# Altium project MB1635.PrjPcb (part 2 of 4)

## Sheet Power_Board.SchDoc: Board power
size A3; Project: STM32MP15-DISCO; Date: Not used; ApprovedBy: Not used; CheckedBy: Not used; Author: Not used; CompanyName: STMicroelectronics; DrawnBy: Not used; Engineer: Not used; Organization: Not used; Address1: Not used; Address2: Not used; Address3: Not used; Address4: Not used; DocumentNumber: 5; Revision: Not used; SheetNumber: 5; SheetTotal: 17; CurrentTime: Not used; CurrentDate: Not used; Time: Not used; DocumentFullPathAndName: Not used; DocumentName: Not used; ModifiedDate: Not used; ImagePath: Not used; ProjectName: Not used; Application_BuildNumber: Not used
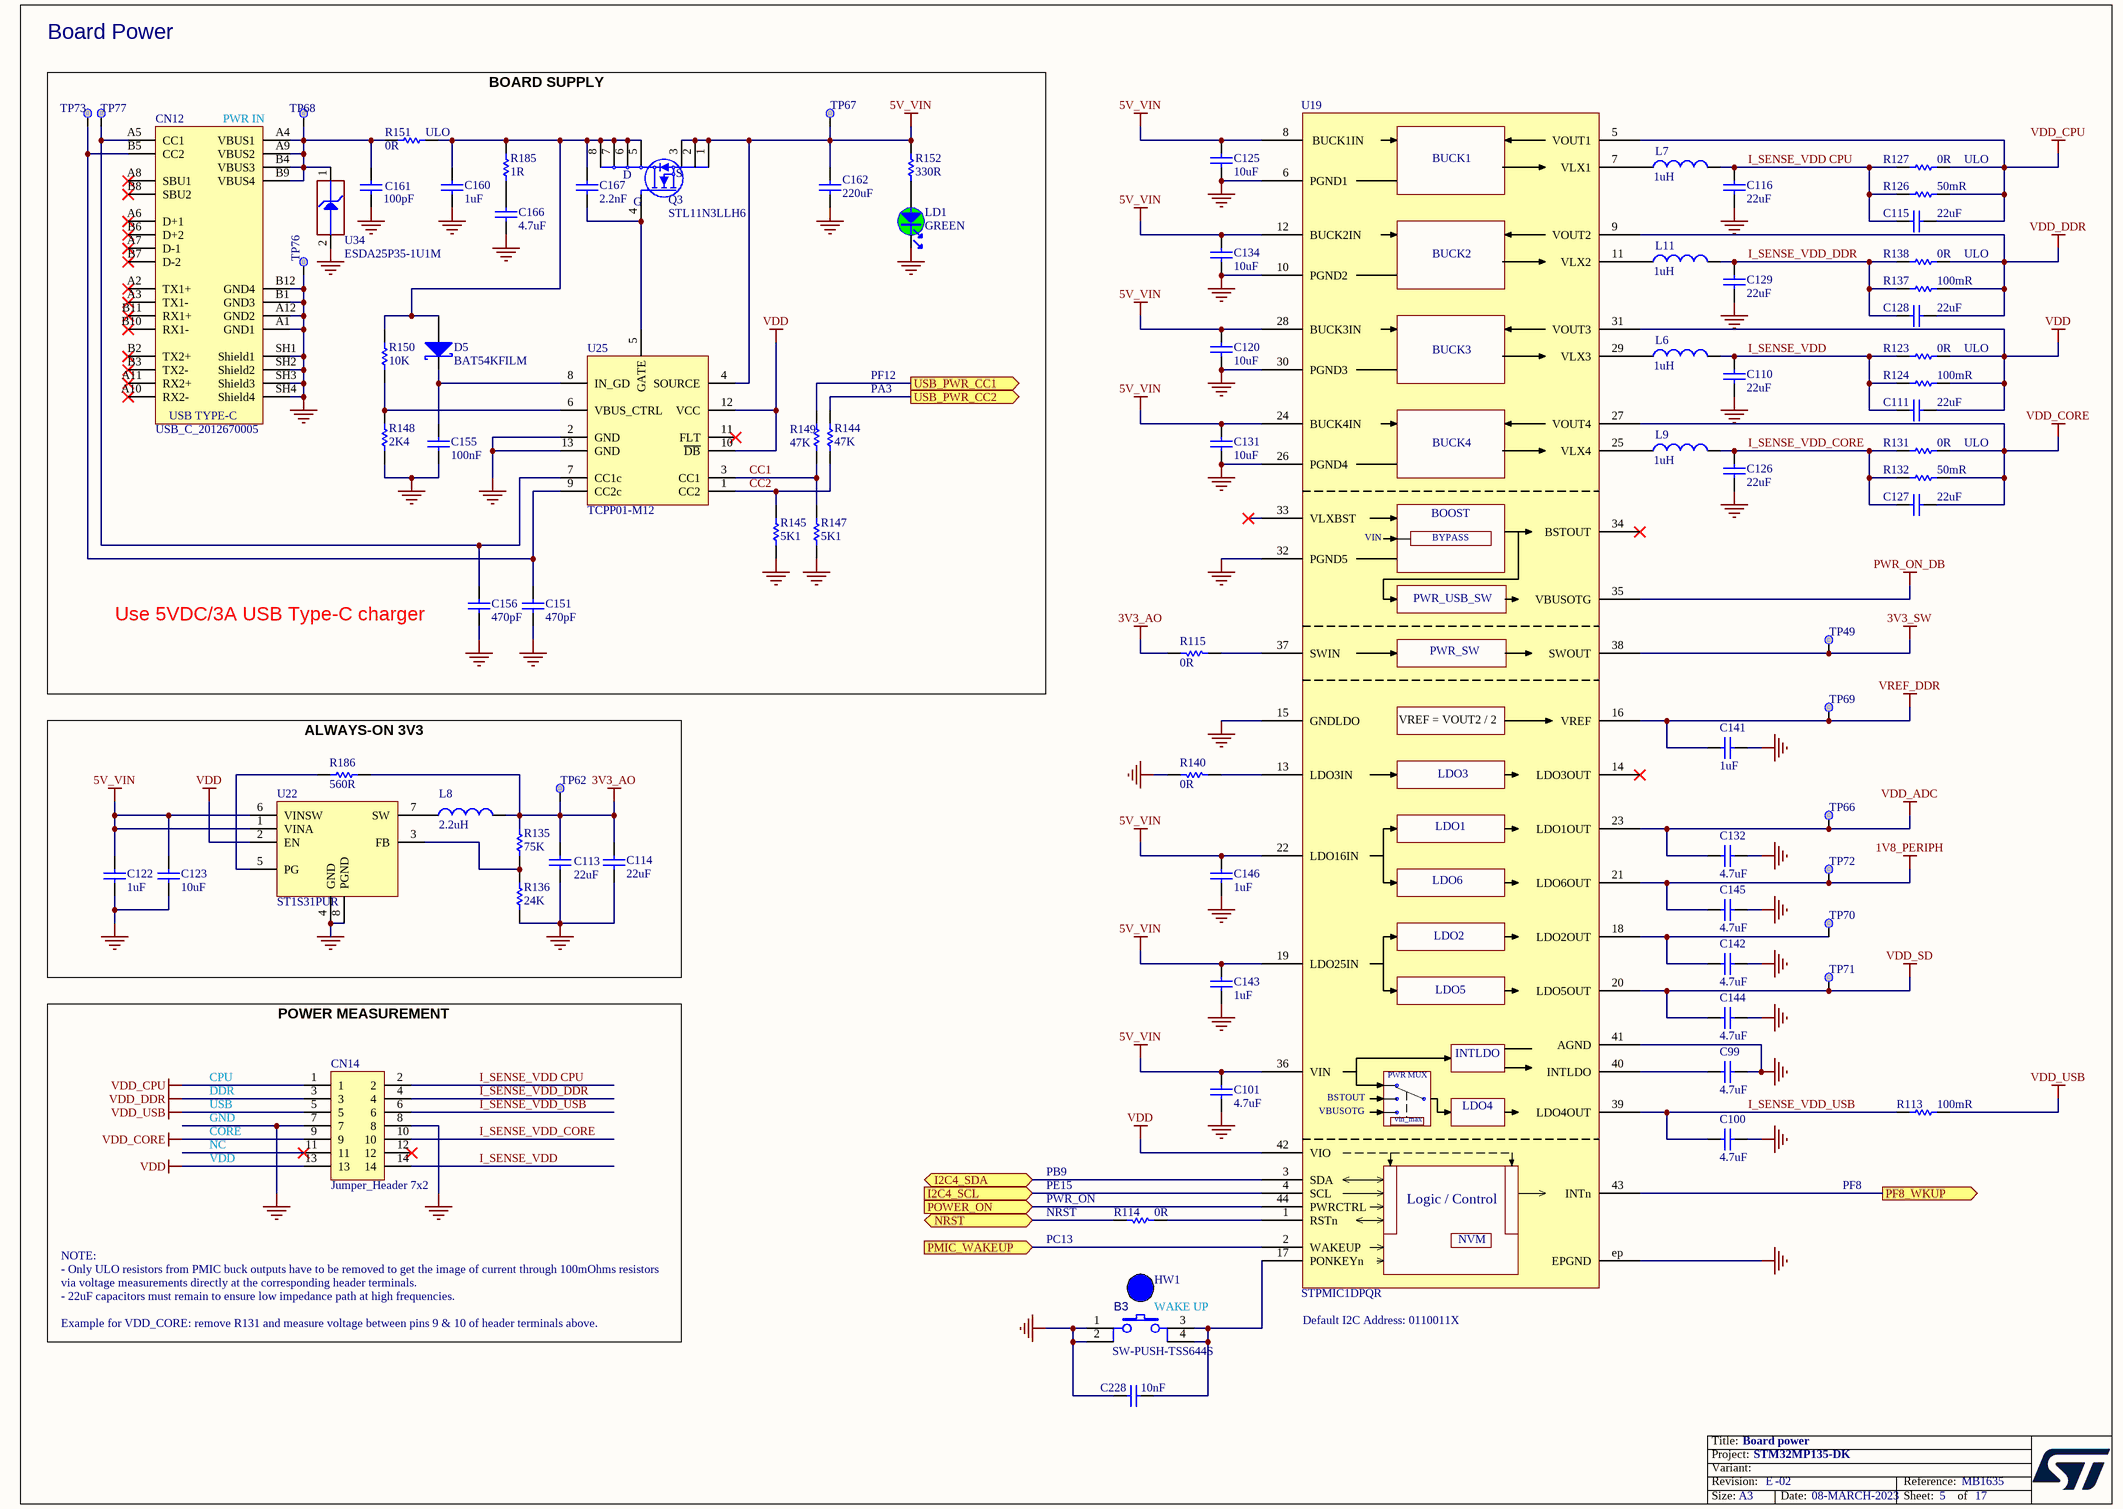
[diagram p3: Power_Board.SchDoc]

### Parts
B3  value SW-PUSH-TSS644S  [SWI_KNITTER_TSS644S]  (hidden comment: SW_PUSH_SMD)
C99  value 4.7uF  [C0402]  (hidden comment: Capacitor)
C100  value 4.7uF  [C0402]  (hidden comment: Capacitor)
C101  value 4.7uF  [C0402]  (hidden comment: Capacitor)
C110  value 22uF  [C0603]  (hidden comment: Capacitor)
C111  value 22uF  [C0603]  (hidden comment: Capacitor)
C113  value 22uF  [C0603]  (hidden comment: Capacitor)
C114  value 22uF  [C0603]  (hidden comment: Capacitor)
C115  value 22uF  [C0603]  (hidden comment: Capacitor)
C116  value 22uF  [C0603]  (hidden comment: Capacitor)
C120  value 10uF  [C0603]  (hidden comment: Capacitor)
C122  value 1uF  [C0402]  (hidden comment: Capacitor)
C123  value 10uF  [C0603]  (hidden comment: Capacitor)
C125  value 10uF  [C0603]  (hidden comment: Capacitor)
C126  value 22uF  [C0603]  (hidden comment: Capacitor)
C127  value 22uF  [C0603]  (hidden comment: Capacitor)
C128  value 22uF  [C0603]  (hidden comment: Capacitor)
C129  value 22uF  [C0603]  (hidden comment: Capacitor)
C131  value 10uF  [C0603]  (hidden comment: Capacitor)
C132  value 4.7uF  [C0402]  (hidden comment: Capacitor)
C134  value 10uF  [C0603]  (hidden comment: Capacitor)
C141  value 1uF  [C0402]  (hidden comment: Capacitor)
C142  value 4.7uF  [C0402]  (hidden comment: Capacitor)
C143  value 1uF  [C0402]  (hidden comment: Capacitor)
C144  value 4.7uF  [C0402]  (hidden comment: Capacitor)
C145  value 4.7uF  [C0402]  (hidden comment: Capacitor)
C146  value 1uF  [C0402]  (hidden comment: Capacitor)
C151  value 470pF  [C0402]  (hidden comment: Capacitor)
C155  value 100nF  [C0603]  (hidden comment: Capacitor)
C156  value 470pF  [C0402]  (hidden comment: Capacitor)
C160  value 1uF  [C0402]  (hidden comment: Capacitor)
C161  value 100pF  [C0402]  (hidden comment: Capacitor)
C162  value 220uF  [C1206_H1P6]  (hidden comment: Capacitor)
C166  value 4.7uF  [C0603]  (hidden comment: Capacitor)
C167  value 2.2nF  [C0603_H0P8]  (hidden comment: Capacitor)
C228  value 10nF  [C0402]  (hidden comment: Capacitor)
CN12  value USB_C_2012670005  [CON_USB-TYPEC_MOLEX_2012670005]  (hidden comment: USB_TYPE_C_Receptacle)
CN14  value Jumper_Header 7x2  [CON_SAMTEC_TSW-107-07-X-D]  (hidden comment: Header 7x2)
D5  value BAT54KFILM  [DIO_SOD523_1A_2K]  (hidden comment: SCHOTTKY_1A_2K)
HW1  Blue Hat  (value not drawn)  (mechanical)
L6  value 1uH  [IND_2520_TOKO_DFE252012P]  (hidden comment: IND_1uH_42mohm_3.2A)
L7  value 1uH  [IND_2520_TOKO_DFE252012P]  (hidden comment: IND_1uH_42mohm_3.2A)
L8  value 2.2uH  [IND_4025_WURTH_74404043022A]  (hidden comment: Inductor)
L9  value 1uH  [IND_2520_TOKO_DFE252012P]  (hidden comment: IND_1uH_42mohm_3.2A)
L11  value 1uH  [IND_2520_TOKO_DFE252012P]  (hidden comment: IND_1uH_42mohm_3.2A)
LD1  value GREEN  [LED_0603_GREEN]  (hidden comment: LED_green)
Q3  STL11N3LLH6  [MOS_POWERFLAT_3P3X3P3_P065]
R113  value 100mR  [R0603]  (hidden comment: Resistor)
R114  value 0R  [R0402]  (hidden comment: Resistor)
R115  value 0R  [R0402]  (hidden comment: Resistor)
R123  value 0R  [R0603]  (hidden comment: Resistor)
R124  value 100mR  [R0603]  (hidden comment: Resistor)
R126  value 50mR  [R0603]  (hidden comment: Resistor)
R127  value 0R  [R0603]  (hidden comment: Resistor)
R131  value 0R  [R0603]  (hidden comment: Resistor)
R132  value 50mR  [R0603]  (hidden comment: Resistor)
R135  value 75K  [R0402]  (hidden comment: Resistor)
R136  value 24K  [R0402]  (hidden comment: Resistor)
R137  value 100mR  [R0603]  (hidden comment: Resistor)
R138  value 0R  [R0603]  (hidden comment: Resistor)
R140  value 0R  [R0402]  (hidden comment: Resistor)
R144  value 47K  [R0402]  (hidden comment: Resistor)
R145  value 5K1  [R0402]  (hidden comment: Resistor)
R147  value 5K1  [R0402]  (hidden comment: Resistor)
R148  value 2K4  [R0402]  (hidden comment: Resistor)
R149  value 47K  [R0402]  (hidden comment: Resistor)
R150  value 10K  [R0402]  (hidden comment: Resistor)
R151  value 0R  [R0603]  (hidden comment: Resistor)
R152  value 330R  [R0402]  (hidden comment: Resistor)
R185  value 1R  [R0603]  (hidden comment: Resistor)
R186  value 560R  [R0402]  (hidden comment: Resistor)
TP49  Test Point  [TP_SMD_1MM]  (value not drawn)  (no BOM)
TP62  Test Point  [TP_SMD_1MM]  (value not drawn)  (no BOM)
TP66  Test Point  [TP_SMD_1MM]  (value not drawn)  (no BOM)
TP67  Test Point  [TP_SMD_1MM]  (value not drawn)  (no BOM)
TP68  Test Point  [TP_SMD_2MM]  (value not drawn)  (no BOM)
TP69  Test Point  [TP_SMD_1MM]  (value not drawn)  (no BOM)
TP70  Test Point  [TP_SMD_1MM]  (value not drawn)  (no BOM)
TP71  Test Point  [TP_SMD_1MM]  (value not drawn)  (no BOM)
TP72  Test Point  [TP_SMD_1MM]  (value not drawn)  (no BOM)
TP73  Test Point  [TP_SMD_1MM]  (value not drawn)  (no BOM)
TP76  Test Point  [TP_SMD_2MM]  (value not drawn)  (no BOM)
TP77  Test Point  [TP_SMD_1MM]  (value not drawn)  (no BOM)
U19  value STPMIC1DPQR  [ICC_WFQFN44-EPAD_5X6_P040]  (hidden comment: STPMU1)
U22  ST1S31PUR  [ICC_VFDFPN8-EPAD_3X3_P065]
U25  TCPP01-M12  [ICC_QFN12L-EPAD_3X3_P050]
U34  value ESDA25P35-1U1M  [ESD_QFN1610_2N_1K_2A]  (hidden comment: ESD-TRANSIL)

### Ports
I2C4_SCL (in), I2C4_SDA (bidir), NRST (bidir), PF8_WKUP (out), PMIC_WAKEUP (in), POWER_ON (in), USB_PWR_CC1 (out), USB_PWR_CC2 (out)

### Nets
1V8_PERIPH: C145.2 TP72.1 U19.21(LDO6OUT)
3V3_AO: C113.2 C114.2 L8.2 R115.1 R135.2 R186.2 TP62.1
3V3_SW: TP49.1 U19.38(SWOUT)
5V_VIN: C101.2 C120.2 C122.2 C123.2 C125.2 C131.2 C134.2 C143.2 C146.2 C162.1 Q3.1(S) Q3.2(S) Q3.3(S) R152.2 TP67.1 U19.8(BUCK1IN) U19.12(BUCK2IN) U19.19(LDO25IN) U19.22(LDO16IN) U19.24(BUCK4IN) U19.28(BUCK3IN) U19.36(VIN) U22.1(VINA) U22.6(VINSW) U25.4(SOURCE)
GND: B3.1 B3.2 C99.2 C100.1 C101.1 C110.1 C113.1 C114.1 C116.1 C120.1 C122.1 C123.1 C125.1 C126.1 C129.1 C131.1 C132.1 C134.1 C141.1 C142.1 C143.1 C144.1 C145.1 C146.1 C151.1 C155.2 C156.1 C160.2 C161.1 C162.2 C166.1 C228.1 CN12.A1(GND1) CN12.A12(GND2) CN12.B1(GND3) CN12.B12(GND4) CN12.SH1(Shield1) CN12.SH2(Shield2) CN12.SH3(Shield3) CN12.SH4(Shield4) CN14.7 CN14.8 LD1.2 R136.1 R140.1 R145.1 R147.1 R148.1 TP76.1 U19.6(PGND1) U19.10(PGND2) U19.15(GNDLDO) U19.26(PGND4) U19.30(PGND3) U19.32(PGND5) U19.41(AGND) U19.ep(EPGND) U22.4(GND) U22.8(PGND) U25.2(GND) U25.13(GND) U34.2(GND)
PWR_ON_DB: U19.35(VBUSOTG)
VDD: C111.2 CN14.13 R123.2 R124.2 U19.31(VOUT3) U19.42(VIO) U22.2(EN) U25.10(~{DB}) U25.12(VCC)
VDD_ADC: C132.2 TP66.1 U19.23(LDO1OUT)
VDD_CORE: C127.2 CN14.9 R131.2 R132.2 U19.27(VOUT4)
VDD_CPU: C115.2 CN14.1 R126.2 R127.2 U19.5(VOUT1)
VDD_DDR: C128.2 CN14.3 R137.2 R138.2 U19.9(VOUT2)
VDD_SD: C144.2 TP71.1 U19.20(LDO5OUT)
VDD_USB: CN14.5 R113.2
VREF_DDR: C141.2 TP69.1 U19.16(VREF)
CC1: R147.2 R149.1 U25.3(CC1)
CC2: R144.1 R145.2 U25.1(CC2)
I2C4_SCL: U19.4(SCL) ; port I2C4_SCL
I2C4_SDA: U19.3(SDA) ; port I2C4_SDA
I_SENSE_VDD: C110.2 C111.1 CN14.14 L6.2 R123.1 R124.1
I_SENSE_VDD CPU: C115.1 C116.2 CN14.2 L7.2 R126.1 R127.1
I_SENSE_VDD_CORE: C126.2 C127.1 CN14.10 L9.2 R131.1 R132.1
I_SENSE_VDD_DDR: C128.1 C129.2 CN14.4 L11.2 R137.1 R138.1
I_SENSE_VDD_USB: C100.2 CN14.6 R113.1 U19.39(LDO4OUT)
NRST: R114.1 ; port NRST
PF8_WKUP: U19.43(INTn) ; port PF8_WKUP
PMIC_WAKEUP: U19.2(WAKEUP) ; port PMIC_WAKEUP
POWER_ON: U19.44(PWRCTRL) ; port POWER_ON
USB_PWR_CC1: R149.2 ; port USB_PWR_CC1
USB_PWR_CC2: R144.2 ; port USB_PWR_CC2
NetB3_3: B3.3 B3.4 C228.2 U19.17(PONKEYn)
NetC99_1: C99.1 U19.40(INTLDO)
NetC142_2: C142.2 TP70.1 U19.18(LDO2OUT)
NetC151_2: C151.2 CN12.B5(CC2) TP73.1 U25.9(CC2c)
NetC155_1: C155.1 D5.2(K) U25.8(IN_GD)
NetC156_2: C156.2 CN12.A5(CC1) TP77.1 U25.7(CC1c)
NetC160_1: C160.1 C167.2 D5.1(A) Q3.5(D) Q3.6(D) Q3.7(D) Q3.8(D) R150.2 R151.2 R185.2
NetC161_2: C161.2 CN12.A4(VBUS1) CN12.A9(VBUS2) CN12.B4(VBUS3) CN12.B9(VBUS4) R151.1 TP68.1 U34.1(IO1)
NetC166_2: C166.2 R185.1
NetC167_1: C167.1 Q3.4(G) U25.5(GATE)
NetL6_1: L6.1 U19.29(VLX3)
NetL7_1: L7.1 U19.7(VLX1)
NetL8_1: L8.1 U22.7(SW)
NetL9_1: L9.1 U19.25(VLX4)
NetL11_1: L11.1 U19.11(VLX2)
NetLD1_1: LD1.1 R152.1
NetR114_2: R114.2 U19.1(RSTn)
NetR115_2: R115.2 U19.37(SWIN)
NetR135_1: R135.1 R136.2 U22.3(FB)
NetR140_2: R140.2 U19.13(LDO3IN)
NetR148_2: R148.2 R150.1 U25.6(VBUS_CTRL)
NetR186_1: R186.1 U22.5(PG)

Not connected (* = marked no-connect by the designer): CN12 A2(TX1+)* A3(TX1-)* A6(D+1)* A7(D-1)* A8(SBU1)* A10(RX2-)* A11(RX2+)* B2(TX2+)* B3(TX2-)* B6(D+2)* B7(D-2)* B8(SBU2)* B10(RX1-)* B11(RX1+)*; CN14 11* 12*; U19 14(LDO3OUT)* 33(VLXBST)* 34(BSTOUT)*; U25 11(FLT)*

### Notes on the sheet
- Board Power
- (near CN12) PWR IN
- (near R151) ULO
- ULO
- PF12
- PA3
- Use 5VDC/3A USB Type-C charger
- BOARD SUPPLY
- ALWAYS-ON 3V3
- CPU
- DDR
- USB
- GND
- VDD
- CORE
- NC
- PB9
- PE15
- PF8
- NRST
- (near R114) PWR_ON
- PC13
- NOTE:
  - Only ULO resistors from PMIC buck outputs have to be removed to get the image of current through 100mOhms resistors via voltage measurements directly at the corresponding header terminals.
  - 22uF capacitors must remain to ensure low impedance path at high frequencies.
  Example for VDD_CORE: remove R131 and measure voltage between pins 9 & 10 of header terminals above.
- (near B3) WAKE UP
- Default I2C Address: 0110011X
- (near CN14) POWER MEASUREMENT
- Title:
- Project:
- Size:
- Revision:
- Variant:
- A3
- -
- Date:
- Reference:
- Sheet:
- of
- (in symbol MCD-02275) BUCK1; BUCK2; BUCK3; BUCK4; BOOST; BYPASS; PWR_USB_SW; PWR_SW; VREF = VOUT2 / 2; LDO3; LDO1; LDO6; LDO2; LDO5; PWR MUX; LDO4; vin_max; Logic / Control; NVM
- (in symbol MCD-02421) USB TYPE-C

### Library data of the parts
B3 = MCD-02417: Push Button, NO, 0.05A, 12V, 2.6N, SMD, 9.0x6.2mm, T=7.3mm, changeable caps KTSC-6xx; Part_Type: Misc; Manufacturer_Part_Number: TSS644S; Manufacturer: KNITTER-SWITCH; Part_Preference: Recommended; Component_Country_Of_Origin: China; ShowFields: YES; ID: 4523; Internal_Part_Number: MCD-02417; Status: Released; ComponentLink1URL: http://tunmcdsvn.tun.st.com/Component_Documentation_Library/Trunk/Misc/KNITTER_TSS6x_Series; Order_Code_Digikey: N/A; Order_Code_Farnell: N/A; Order_Code_RS: N/A; Package: 9.0x6.2mm
C99-C101 C132 C142 C144 C145 = MCD-01356: Capacitor, MLCC, 4.7uF, 6V3, X5R, +/-20%, 0402, T=0.5mm; Manufacturer_Part_Number: GRM155R60J475ME47; Manufacturer: MURATA; Part_Preference: Recommended; Order_Code_RS: 814-5230; Component_Country_Of_Origin: Japan; ShowFields: YES; ID: 3456; Internal_Part_Number: MCD-01356; Status: Released; Part_Type: Capacitor; Package: 0402; ComponentLink1URL: http://tunmcdsvn.tun.st.com/Component_Documentation_Library/Trunk/Capacitor/MURATA_GRM_Series; Order_Code_Digikey: 490-5915-1-ND; Order_Code_Farnell: 2666407
C110 C116 C126 C129 = MCD-00100: Capacitor, MLCC, 22uF, 6V3, X5R, +/-20%, 0603, T=0.8mm; Manufacturer_Part_Number: GRM188R60J226MEA0J; Manufacturer: MURATA; Part_Preference: Recommended; Component_Country_Of_Origin: Japan; ShowFields: YES; ID: 2766; Internal_Part_Number: MCD-00100; Status: Released; Part_Type: Capacitor; Package: 0603; ComponentLink1URL: http://tunmcdsvn.tun.st.com/Component_Documentation_Library/Trunk/Capacitor/MURATA_GRM_Series; Order_Code_Digikey: 490-7612-2-ND; Order_Code_Farnell: N/A; Order_Code_RS: N/A
C111 C113-C115 C127 C128 = MCD-00100: Capacitor, MLCC, 22uF, 6V3, X5R, +/-20%, 0603, T=0.8mm; Part_Preference: Recommended; Manufacturer: MURATA; Manufacturer_Part_Number: GRM188R60J226MEA0J; Component_Country_Of_Origin: Japan; ShowFields: YES; ID: 2766; Internal_Part_Number: MCD-00100; Status: Released; Part_Type: Capacitor; Package: 0603; ComponentLink1URL: http://tunmcdsvn.tun.st.com/Component_Documentation_Library/Trunk/Capacitor/MURATA_GRM_Series; Order_Code_Digikey: 490-7612-2-ND; Order_Code_Farnell: N/A; Order_Code_RS: N/A
C120 C125 C131 C134 = MCD-00099: Capacitor, MLCC, 10uF, 10V, X5R, +/-10%, 0603, T=0.8mm; Manufacturer_Part_Number: GRM188R61A106KE69D; Manufacturer: MURATA; Part_Preference: Recommended; Order_Code_RS: 170-6168; Component_Country_Of_Origin: Japan; ShowFields: YES; ID: 2770; Internal_Part_Number: MCD-00099; Status: Released; Part_Type: Capacitor; Package: 0603; ComponentLink1URL: http://tunmcdsvn.tun.st.com/Component_Documentation_Library/Trunk/Capacitor/MURATA_GRM_Series; Order_Code_Digikey: 490-10474-1-ND; Order_Code_Farnell: 2494233
C122 = MCD-00095: Capacitor, MLCC, 1uF, 25V, X5R, +/-10%, 0402, T=0.5mm; Part_Preference: Recommended; Manufacturer: MURATA; Manufacturer_Part_Number: GRM155R61E105KA12; Order_Code_RS: 846-7287; Component_Country_Of_Origin: Japan; ShowFields: YES; ID: 2772; Internal_Part_Number: MCD-00095; Status: Released; Part_Type: Capacitor; Package: 0402; ComponentLink1URL: http://tunmcdsvn.tun.st.com/Component_Documentation_Library/Trunk/Capacitor/MURATA_GRM_Series; Order_Code_Digikey: 490-10017-1-ND; Order_Code_Farnell: 2218855
C123 = MCD-00099: Capacitor, MLCC, 10uF, 10V, X5R, +/-10%, 0603, T=0.8mm; Part_Preference: Recommended; Manufacturer: MURATA; Manufacturer_Part_Number: GRM188R61A106KE69D; Order_Code_RS: 170-6168; Component_Country_Of_Origin: Japan; ShowFields: YES; ID: 2770; Internal_Part_Number: MCD-00099; Status: Released; Part_Type: Capacitor; Package: 0603; ComponentLink1URL: http://tunmcdsvn.tun.st.com/Component_Documentation_Library/Trunk/Capacitor/MURATA_GRM_Series; Order_Code_Digikey: 490-10474-1-ND; Order_Code_Farnell: 2494233
C141 C143 C146 C160 = MCD-00095: Capacitor, MLCC, 1uF, 25V, X5R, +/-10%, 0402, T=0.5mm; Manufacturer_Part_Number: GRM155R61E105KA12; Manufacturer: MURATA; Part_Preference: Recommended; Order_Code_RS: 846-7287; Component_Country_Of_Origin: Japan; ShowFields: YES; ID: 2772; Internal_Part_Number: MCD-00095; Status: Released; Part_Type: Capacitor; Package: 0402; ComponentLink1URL: http://tunmcdsvn.tun.st.com/Component_Documentation_Library/Trunk/Capacitor/MURATA_GRM_Series; Order_Code_Digikey: 490-10017-1-ND; Order_Code_Farnell: 2218855
C151 C156 = MCD-00724: Capacitor, MLCC, 470pF, 50V, NPO, +/-5%, 0402, T=0.5mm; Manufacturer_Part_Number: CC0402JRNPO9BN471; Manufacturer: YAGEO; Part_Preference: Recommended; Order_Code_RS: 199-2186; Component_Country_Of_Origin: China; ShowFields: YES; ID: 3023; Internal_Part_Number: MCD-00724; Status: Released; Part_Type: Capacitor; Package: 0402; ComponentLink1URL: http://tunmcdsvn.tun.st.com/Component_Documentation_Library/Trunk/Capacitor/YAGEO_NP0_Series; Order_Code_Digikey: 311-1671-1-ND; Order_Code_Farnell: 3366416
C155 = MCD-01099: Capacitor, MLCC, 100nF, 50V, X7R, +/-10%, 0603, T=0.8mm; Manufacturer_Part_Number: CC0603KRX7R9BB104; Manufacturer: YAGEO; Part_Preference: Recommended; BMS_Part_Number: 9142278; Order_Code_RS: 669-8767; Component_Country_Of_Origin: China; ShowFields: YES; ID: 3397; Internal_Part_Number: MCD-01099; Status: Released; Part_Type: Capacitor; Package: 0603; ComponentLink1URL: http://tunmcdsvn.tun.st.com/Component_Documentation_Library/Trunk/Capacitor/YAGEO_X7R_Series; Order_Code_Digikey: 311-1344-1-ND; Order_Code_Farnell: 1362556
C161 = MCD-00205: Capacitor, MLCC, 100pF, 50V, NPO, +/-5%, 0402, T=0.5mm; Manufacturer_Part_Number: CC0402JRNPO9BN101; Manufacturer: YAGEO; Part_Preference: Recommended; Component_Country_Of_Origin: China; ShowFields: YES; ID: 2658; Internal_Part_Number: MCD-00205; Status: Released; Part_Type: Capacitor; Package: 0402; ComponentLink1URL: http://tunmcdsvn.tun.st.com/Component_Documentation_Library/Trunk/Capacitor/YAGEO_NP0_Series; Order_Code_Digikey: 311-1024-1-ND; Order_Code_Farnell: 3019226RL; Order_Code_RS: N/A
C162 = MCD-00104: Capacitor, MLCC, 220uF, 6V3, X5R, +/-20%, 1206, T=1.6mm; Manufacturer_Part_Number: GRM31CR60J227ME11; Manufacturer: MURATA; Part_Preference: Recommended; Order_Code_RS: 170-6396; Component_Country_Of_Origin: Japan; ShowFields: YES; ID: 2764; Internal_Part_Number: MCD-00104; Status: Released; Part_Type: Capacitor; Package: 1206; ComponentLink1URL: http://tunmcdsvn.tun.st.com/Component_Documentation_Library/Trunk/Capacitor/MURATA_GRM_Series; Order_Code_Digikey: 490-13970-1-ND; Order_Code_Farnell: 2494472
C166 = MCD-02196: Capacitor, MLCC, 4.7uF, 25V, X5R, +/-10%, 0603, T=0.8mm; Manufacturer_Part_Number: C1608X5R1E475K080AC; Manufacturer: TDK; Part_Preference: Recommended; Order_Code_RS: 9159158; Component_Country_Of_Origin: Unknown; ShowFields: YES; ID: 4296; Internal_Part_Number: MCD-02196; Status: Checked; Part_Type: Capacitor; Package: 0603; ComponentLink1URL: http://tunmcdsvn.tun.st.com/Component_Documentation_Library/Trunk/Capacitor/TDK_C_Series; Order_Code_Digikey: 445-9050-1-ND; Order_Code_Farnell: 2525101
C167 = MCD-02457: Capacitor, MLCC, 2.2nF, 50V, C0G/NPO, +/-5%, 0603, T=0,8mm; Part_Preference: Recommended; Manufacturer: YAGEO; Manufacturer_Part_Number: CC0603JRNPO9BN222; Order_Code_RS: 200-6484; Component_Country_Of_Origin: China; ShowFields: YES; ID: 4563; Internal_Part_Number: MCD-02457; Status: Released; Part_Type: Capacitor; Package: 0603; ComponentLink1URL: http://tunmcdsvn.tun.st.com/Component_Documentation_Library/Trunk/Capacitor/YAGEO_NP0_Series/; Order_Code_Digikey: 311-1771-2-ND; Order_Code_Farnell: 3369209
C228 = MCD-02198: Capacitor, MLCC, 10nF, 50V, X7R, +/-10%, 0402, T=0.5mm; Manufacturer_Part_Number: CC0402KRX7R9BB103; Manufacturer: YAGEO; Part_Preference: Recommended; Order_Code_RS: 6169644; Component_Country_Of_Origin: China; ShowFields: YES; ID: 4298; Internal_Part_Number: MCD-02198; Status: Checked; Part_Type: Capacitor; Package: 0402; ComponentLink1URL: http://tunmcdsvn.tun.st.com/Component_Documentation_Library/Trunk/Capacitor/YAGEO_X7R_Series; Order_Code_Digikey: N/A; Order_Code_Farnell: N/A
CN12 = MCD-02421: USB_TypeC, 24 pins, RA, SMD, T=3.71mm (USB Certified 3.1); Part_Type: Connector; Manufacturer_Part_Number: 2012670005; Manufacturer: MOLEX; Part_Preference: Recommended; Order_Code_RS: 176-8434; Component_Country_Of_Origin: Unknown; ShowFields: YES; ID: 4527; Internal_Part_Number: MCD-02421; Status: Released; ComponentLink1URL: http://tunmcdsvn.tun.st.com/Component_Documentation_Library/Trunk/Connector/MOLEX_201267_Series; Order_Code_Digikey: WM17992TR-ND; Order_Code_Farnell: 2990523
CN14 = MCD-02123: Header, 7x2, 2.54mm, VR, TH, T=5.84mm/2.54mm; Part_Preference: Recommended; Part_Type: Connector; Manufacturer: SAMTEC; Manufacturer_Part_Number: TSW-107-07-G-D; Component_Country_Of_Origin: China, Costa Rica, Malaysia, United States, Vietnam; ShowFields: YES; ID: 4223; Internal_Part_Number: MCD-02123; Status: Checked; ComponentLink1URL: http://tunmcdsvn.tun.st.com/Component_Documentation_Library/Trunk/Connector/SAMTEC_TSW_Series/; Order_Code_Digikey: N/A; Order_Code_Farnell: N/A; Order_Code_RS: N/A
D5 = MCD-01677: Small signal Schottky diodes; BMS_Part_Number: 9151123; Part_Preference: Recommended; Part_Type: Diode; Manufacturer: STMICROELECTRONICS; Manufacturer_HQ_COO: EU; Component_Country_Of_Origin: China; ShowFields: YES; ID: 3777; Internal_Part_Number: MCD-01677; Status: Checked; Manufacturer_Part_Number: BAT54KFILM; Package: SOD-523; ComponentLink1URL: http://tunmcdsvn.tun.st.com/Component_Datasheet_Library/Trunk/Diodes/STM_SCHOTTKY_DOUBLE_BAT54SWFILM/STM_SCHOTTKY_DOUBLE_BAT54SWFILM.pdf
HW1 = MCD-02136: Switch hat, blue, For KTSC-62B; Part_Type: Misc; Part_Preference: Recommended; Manufacturer: APEM INC; Manufacturer_Part_Number: AKTSC62B; Order_Code_RS: 378-6779; Component_Country_Of_Origin: Unknown; ShowFields: YES; ID: 4236; Value: Blue Hat; Order_Code_Digikey: AKTSC62B-ND; Order_Code_Farnell: N/A; Status: Released; ComponentLink1URL: http://tunmcdsvn.tun.st.com/Component_Datasheet_Library/Trunk/Mechanical/APEM_BLUEHAT_KTSC62; Internal_Part_Number: MCD-02136
L6 L7 L9 L11 = MCD-01122: Inductor, 1uH, +/-20%, 4.3A max, 0R042, 2520, T=1.2mm; Manufacturer_Part_Number: DFE252012P-1ROM=P2; Manufacturer: MURATA; Part_Preference: Recommended; Component_Country_Of_Origin: Japan; ShowFields: YES; ID: 3373; Internal_Part_Number: MCD-01122; Status: Checked; Part_Type: Inductor; Package: 2520; ComponentLink1URL: http://tunmcdsvn.tun.st.com/Component_Documentation_Library/Trunk/Inductor/MURATA_DFE252012P_Series; Order_Code_Digikey: N/A; Order_Code_Farnell: N/A; Order_Code_RS: N/A
L8 = MCD-02242: Inductor, 2.2uH, +/-30%, 3,83A, 0R023, 4x4mm, T=2.5mm; Part_Preference: Recommended; Manufacturer: WURTH ELEKTRONIK; Manufacturer_Part_Number: 74404043022A; Component_Country_Of_Origin: Unknown; ShowFields: YES; ID: 4342; Internal_Part_Number: MCD-02242; Status: Released; Part_Type: Inductor; Package: 4x4mm; ComponentLink1URL: http://tunmcdsvn.tun.st.com/Component_Documentation_Library/Trunk/Inductor/WURTH_ELEKTRONIK_74404043022A; Order_Code_Digikey: 732-10754-2-ND; Order_Code_Farnell: 2749069; Order_Code_RS: N/A
LD1 = MCD-00050: LED, Green, 0603; Part_Type: Display; Manufacturer_Part_Number: 19-213SYGC/S530-E2/TR8; Manufacturer: EVERLIGHT; Part_Preference: Forbidden; Component_Country_Of_Origin: China; ShowFields: YES; ID: 2542; Internal_Part_Number: MCD-00050; Status: Obsolete; ComponentLink1URL: http://tunmcdsvn.tun.st.com/Component_Datasheet_Library/Trunk/Display/Everlight_SMD-LED-GREEN_19-213SYGC-S530-XX-TR8-v3.doc; Package: LED 0603
Q3 = MCD-01810: N-channel 30 V, 6 mΩ typ, 11 A STripFET™ H6, Power MOSFET in a PowerFLAT™ 3.3x3.3 package; Part_Type: IC; Manufacturer: STMICROELECTRONICS; BMS_Part_Number: 9153561; Part_Preference: Recommended; Manufacturer_HQ_COO: EU; Component_Country_Of_Origin: China; ShowFields: YES; ID: 3910; Internal_Part_Number: MCD-01810; Value: STL11N3LLH6; Status: Released; Manufacturer_Part_Number: STL11N3LLH6; Package: PowerFLAT 3.3x3.3; ComponentLink1URL: http://tunmcdsvn.tun.st.com/Component_Datasheet_Library/Trunk/IC/STM_POWER_MOSFET_STL11N3LLH6
R113 R124 R137 = MCD-02234: Resistor, 100mR, 0603, +/- 1%, 1/3W; Part_Preference: Recommended; Manufacturer: PANASONIC; Manufacturer_Part_Number: ERJ-3BWFR100V; Order_Code_RS: 763-8731; Component_Country_Of_Origin: Japan; ShowFields: YES; ID: 4334; Internal_Part_Number: MCD-02234; Status: Checked; Part_Type: Resistor; Package: 0603; ComponentLink1URL: http://tunmcdsvn.tun.st.com/Component_Documentation_Library/Trunk/Resistor/PANASONIC_ERJ_Series; Order_Code_Digikey: P17478CT-ND; Order_Code_Farnell: 1798596
R114 R115 R140 = MCD-00052: as R103 on sheet MP135_11x11; Internal_Part_Number: MCD-00052; Status: Released; Part_Type: Resistor; Package: 0402; ComponentLink1URL: http://tunmcdsvn.tun.st.com/Component_Documentation_Library/Trunk/Resistor/YAGEO_RC_L_Series; Order_Code_Digikey: 311-0.0JRCT-ND; Order_Code_Farnell: 9232516RL
R123 R127 R131 R138 = MCD-00181: Resistor, 0R, 0603, +/- 0.5mR, 1/4W; Part_Preference: Recommended; Manufacturer: ROHM; Manufacturer_Part_Number: PMR03EZPJ000; Component_Country_Of_Origin: Philippines, Thailand; ShowFields: YES; ID: 2691; Internal_Part_Number: MCD-00181; Status: Released; Part_Type: Resistor; Package: 0603; ComponentLink1URL: http://tunmcdsvn.tun.st.com/Component_Documentation_Library/Trunk/Resistor/ROHM_PMR_Series; Order_Code_Digikey: PMR03EZPJ000-ND; Order_Code_Farnell: N/A; Order_Code_RS: N/A
R126 R132 = MCD-02233: Resistor, 50mR, 0603, +/-1%, 1/3W; Part_Preference: Recommended; Manufacturer: PANASONIC; Manufacturer_Part_Number: ERJ-3BWFR050V; Order_Code_RS: RA; Component_Country_Of_Origin: Japan; ShowFields: YES; ID: 4333; Internal_Part_Number: MCD-02233; Status: Checked; Part_Type: Resistor; Package: 0603; ComponentLink1URL: http://tunmcdsvn.tun.st.com/Component_Documentation_Library/Trunk/Resistor/PANASONIC_ERJ_Series; Order_Code_Digikey: ERJ-3BWFR050V; Order_Code_Farnell: 2493026
R135 = MCD-00521: Resistor, 75K, 0402, +/-1%, 1/16W; Part_Preference: Recommended; Manufacturer: YAGEO; Manufacturer_Part_Number: RC0402FR-0775KL; Component_Country_Of_Origin: China; ShowFields: YES; ID: 3220; Internal_Part_Number: MCD-00521; Status: Released; Part_Type: Resistor; Package: 0402; ComponentLink1URL: http://tunmcdsvn.tun.st.com/Component_Documentation_Library/Trunk/Resistor/YAGEO_RC_L_Series; Order_Code_Digikey: 311-75KLRCT-ND; Order_Code_Farnell: 1458825; Order_Code_RS: N/A
R136 = MCD-00435: Resistor, 24K, 0402, +/-1%, 1/16W; Part_Preference: Recommended; Manufacturer: YAGEO; Manufacturer_Part_Number: RC0402FR-0724KL; Component_Country_Of_Origin: China; ShowFields: YES; ID: 2845; Internal_Part_Number: MCD-00435; Status: Released; Part_Type: Resistor; Package: 0402; ComponentLink1URL: http://tunmcdsvn.tun.st.com/Component_Documentation_Library/Trunk/Resistor/YAGEO_RC_L_Series; Order_Code_Digikey: 311-24KLRCT-ND; Order_Code_Farnell: N/A; Order_Code_RS: N/A
R144 R149 = MCD-00063: Resistor, 47K, 0402, +/-1%, 1/16W; Manufacturer_Part_Number: RC0402FR-0747KL; Manufacturer: YAGEO; Part_Preference: Recommended; Component_Country_Of_Origin: China; ShowFields: YES; ID: 2528; Internal_Part_Number: MCD-00063; Status: Released; Part_Type: Resistor; Package: 0402; ComponentLink1URL: http://tunmcdsvn.tun.st.com/Component_Documentation_Library/Trunk/Resistor/YAGEO_RC_L_Series; Order_Code_Digikey: 311-47.0KLRCT-ND; Order_Code_Farnell: 9239430; Order_Code_RS: N/A
R145 R147 = MCD-00333: Resistor, 5K1, 0402, +/-1%, 1/16W; Manufacturer_Part_Number: RC0402FR-075K1L; Manufacturer: YAGEO; Part_Preference: Recommended; Component_Country_Of_Origin: China; ShowFields: YES; ID: 2944; Internal_Part_Number: MCD-00333; Status: Released; Part_Type: Resistor; Package: 0402; ComponentLink1URL: http://tunmcdsvn.tun.st.com/Component_Documentation_Library/Trunk/Resistor/YAGEO_RC_L_Series; Order_Code_Digikey: 311-5.10KLRCT-ND; Order_Code_Farnell: 1458805; Order_Code_RS: N/A
R148 = MCD-00433: Resistor, 2K4, 0402, +/-1%, 1/16W; Part_Preference: Recommended; Manufacturer: YAGEO; Manufacturer_Part_Number: RC0402FR-072K4L; Component_Country_Of_Origin: China; ShowFields: YES; ID: 2843; Internal_Part_Number: MCD-00433; Status: Released; Part_Type: Resistor; Package: 0402; ComponentLink1URL: http://tunmcdsvn.tun.st.com/Component_Documentation_Library/Trunk/Resistor/YAGEO_RC_L_Series; Order_Code_Digikey: 311-2.40KLRCT-ND; Order_Code_Farnell: 1458767; Order_Code_RS: N/A
R150 = MCD-00053: Resistor, 10K, 0402, +/-1%, 1/16W; BMS_Part_Number: 9131590; Part_Preference: Recommended; Manufacturer: YAGEO; Manufacturer_Part_Number: RC0402FR-0710KL; Component_Country_Of_Origin: China; ShowFields: YES; ID: 2539; Internal_Part_Number: MCD-00053; Status: Released; Part_Type: Resistor; Package: 0402; ComponentLink1URL: http://tunmcdsvn.tun.st.com/Component_Documentation_Library/Trunk/Resistor/YAGEO_RC_L_Series; Order_Code_Digikey: 311-10.0KLRCT-ND; Order_Code_Farnell: 9239359; Order_Code_RS: N/A
R151 = MCD-00181: Resistor, 0R, 0603, +/- 0.5mR, 1/4W; Manufacturer_Part_Number: PMR03EZPJ000; Manufacturer: ROHM; Part_Preference: Recommended; Component_Country_Of_Origin: Philippines, Thailand; ShowFields: YES; ID: 2691; Internal_Part_Number: MCD-00181; Status: Released; Part_Type: Resistor; Package: 0603; ComponentLink1URL: http://tunmcdsvn.tun.st.com/Component_Documentation_Library/Trunk/Resistor/ROHM_PMR_Series; Order_Code_Digikey: PMR03EZPJ000-ND; Order_Code_Farnell: N/A; Order_Code_RS: N/A
R152 = MCD-00062: Resistor, 330R, 0402, +/-1%, 1/16W; Manufacturer_Part_Number: RC0402FR-07330RL; Manufacturer: YAGEO; Part_Preference: Recommended; Component_Country_Of_Origin: China; ShowFields: YES; ID: 2529; Internal_Part_Number: MCD-00062; Status: Released; Part_Type: Resistor; Package: 0402; ComponentLink1URL: http://tunmcdsvn.tun.st.com/Component_Documentation_Library/Trunk/Resistor/YAGEO_RC_L_Series; Order_Code_Digikey: 311-330LRCT-ND; Order_Code_Farnell: 9239170; Order_Code_RS: N/A
R185 = MCD-01512: Resistor, 1R, 0603, +/-1%, 1/10W; Part_Preference: Recommended; Manufacturer: YAGEO; Manufacturer_Part_Number: RC0603FR-071RL; Component_Country_Of_Origin: China; ShowFields: YES; ID: 3612; Internal_Part_Number: MCD-01512; Status: Released; Part_Type: Resistor; Package: 0603; ComponentLink1URL: http://tunmcdsvn.tun.st.com/Component_Documentation_Library/Trunk/Resistor/YAGEO_RC_L_Series; Order_Code_Digikey: 311-1.00HRCT-ND; Order_Code_Farnell: 9238123; Order_Code_RS: N/A
R186 = MCD-00489: Resistor, 560R, 0402, +/-1%, 1/16W; Part_Preference: Recommended; Manufacturer: YAGEO; Manufacturer_Part_Number: RC0402FR-07560RL; Component_Country_Of_Origin: China; ShowFields: YES; ID: 2789; Internal_Part_Number: MCD-00489; Status: Released; Part_Type: Resistor; Package: 0402; ComponentLink1URL: http://tunmcdsvn.tun.st.com/Component_Documentation_Library/Trunk/Resistor/YAGEO_RC_L_Series; Order_Code_Digikey: 311-560LRCT-ND; Order_Code_Farnell: 9239200; Order_Code_RS: N/A
TP49 TP62 TP66 TP67 TP69-TP73 TP77 = MCD-00074: as TP50 on sheet MP135_11x11; Internal_Part_Number: MCD-00074; Status: Released; ComponentLink1URL: http://na; Manufacturer: N/A; Manufacturer_Part_Number: N/A; Order_Code_Digikey: N/A; Order_Code_Farnell: N/A; Order_Code_RS: N/A
TP68 TP76 = MCD-00177: Test Point 2mm; Part_Type: Misc; Part_Preference: Recommended; ShowFields: YES; ID: 2690; Internal_Part_Number: MCD-00177; Status: Released; Manufacturer_Part_Number: N/A; Manufacturer: N/A; ComponentLink1URL: http://na; Order_Code_Digikey: N/A; Order_Code_Farnell: N/A; Order_Code_RS: N/A
U19 = MCD-02275: ST PMIC: 4 step-down +1 advanced boost SMPS, 6 LDOs, 2 pwr switches, DDR Vref, NVM option 'D' for IO@3.3V; Part_Preference: Recommended; Part_Type: IC; Manufacturer: STMICROELECTRONICS; Component_Country_Of_Origin: Philippines; ShowFields: YES; ID: 4375; Internal_Part_Number: MCD-02275; Status: Released; Manufacturer_Part_Number: STPMIC1DPQR; Package: WFQFN 5.0x6.0x0.80mm; ComponentLink1URL: http://tunmcdsvn.tun.st.com/Component_Documentation_Library/Trunk/IC/STMICROELECTRONICS_STPMIC1; Order_Code_Digikey: N/A; Order_Code_Farnell: N/A; Order_Code_RS: N/A
U22 = MCD-02243: 3A DC step-down switching regulator 1,5MHz; Part_Preference: Recommended; Part_Type: IC; Manufacturer: STMICROELECTRONICS; Manufacturer_HQ_COO: EU; Component_Country_Of_Origin: Malaysia; ShowFields: YES; ID: 4343; Internal_Part_Number: MCD-02243; Status: Released; Manufacturer_Part_Number: ST1S31PUR; Package: VFDFPN 3x3mm - 8L; ComponentLink1URL: http://tunmcdsvn.tun.st.com/Component_Datasheet_Library/Trunk/IC/STM_DC-DC_converter_ST1S31PUR; Value: ST1S31PUR; Order_Code_Digikey: N/A; Order_Code_Farnell: N/A; Order_Code_RS: N/A
U25 = MCD-01809: USB Type-C Port Protection for USB Power Delivery, PPS compliant; BMS_Part_Number: 9151145; Part_Preference: Recommended; Part_Type: IC; Manufacturer: STMICROELECTRONICS; Manufacturer_HQ_COO: EU; Component_Country_Of_Origin: Malaysia; ShowFields: YES; ID: 3909; Internal_Part_Number: MCD-01809; Value: TCPP01-M12; Status: Released; Manufacturer_Part_Number: TCPP01-M12; Package: QFN-12L; ComponentLink1URL: http://tunmcdsvn.tun.st.com/Component_Datasheet_Library/Trunk/IC/STM_UCPD_Protection_TCPP01-M12
U34 = MCD-01207: High power Transient voltage suppressor:25V/35A EOS and ESD transients protection.; BMS_Part_Number: 9179045; Part_Preference: Recommended; Part_Type: Diode; Manufacturer: STMICROELECTRONICS; Manufacturer_HQ_COO: EU; Component_Country_Of_Origin: China; ShowFields: YES; ID: 3289; Internal_Part_Number: MCD-01207; Status: Released; Manufacturer_Part_Number: ESDA25P35-1U1M; Package: QFN1610; ComponentLink1URL: http://tunmcdsvn.tun.st.com/Component_Datasheet_Library/Trunk/Diodes/STM_ESD_ESDA25P35-1U1M

## Sheet LCD4.3.SchDoc: LCD 4.3"
size A4; Date: Not used; ApprovedBy: Not used; CheckedBy: Not used; Author: Not used; CompanyName: STMicroelectronics; DrawnBy: Not used; Engineer: Not used; Organization: Not used; Address1: Not used; Address2: Not used; Address3: Not used; Address4: Not used; DocumentNumber: 10; Revision: Not used; SheetNumber: 10; SheetTotal: 17; CurrentTime: Not used; CurrentDate: Not used; Time: Not used; DocumentFullPathAndName: Not used; DocumentName: Not used; ModifiedDate: Not used; ImagePath: Not used; ProjectName: Not used; Application_BuildNumber: Not used
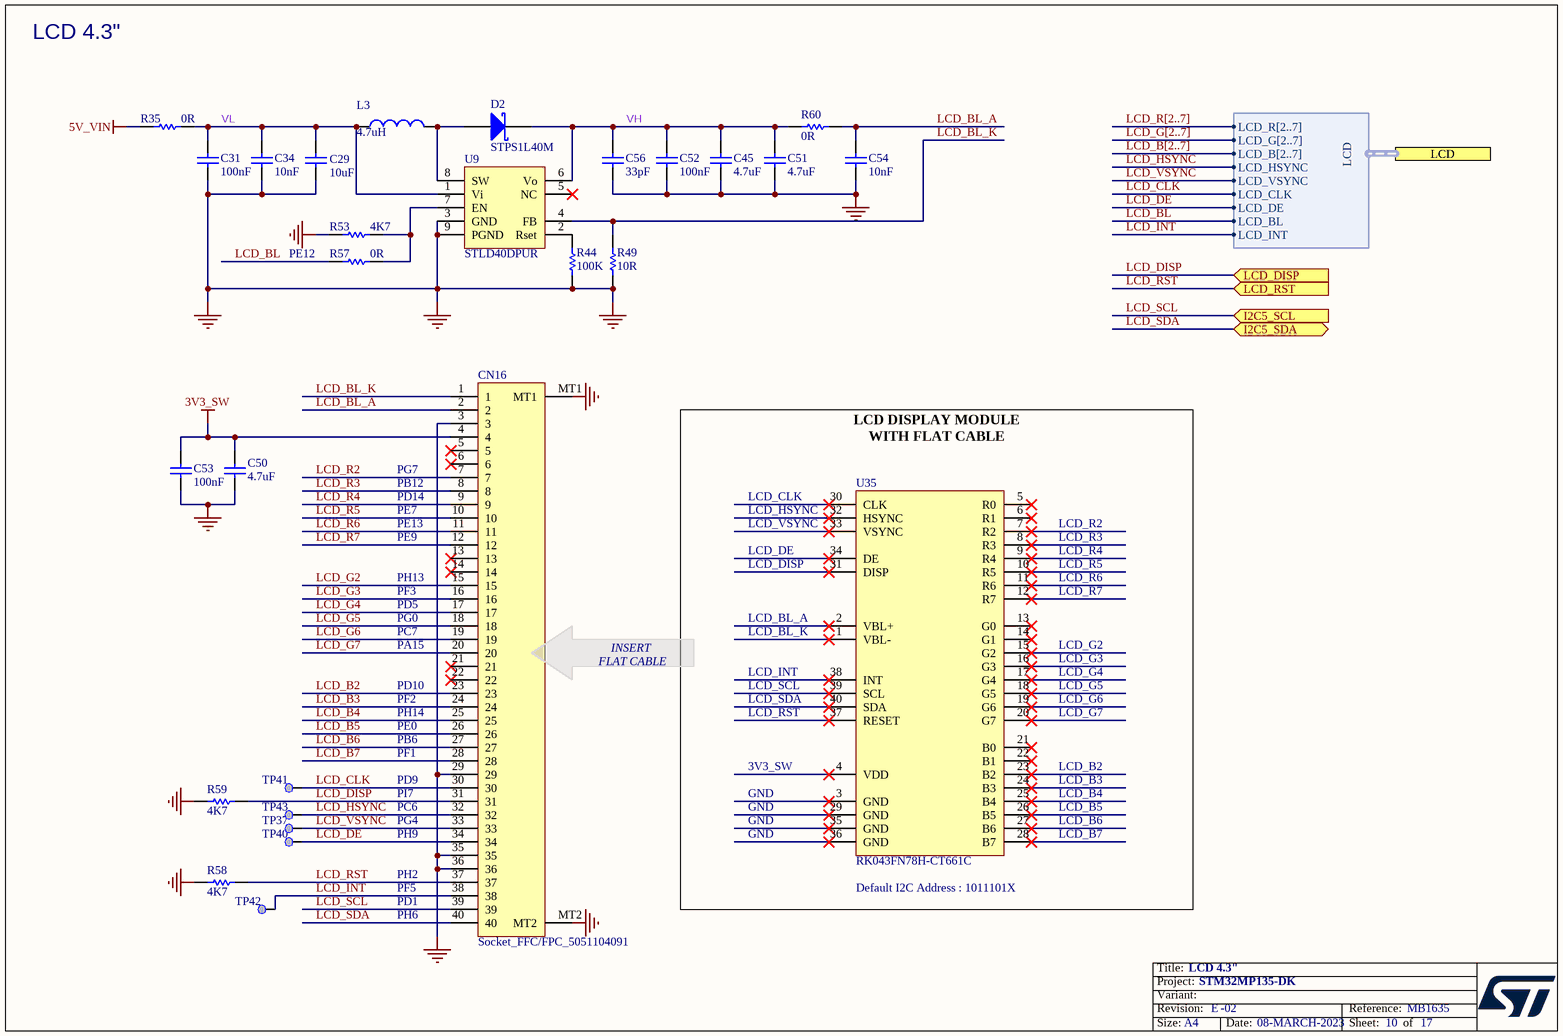
[diagram p4: LCD4.3.SchDoc]

### Parts
C29  value 10uF  [C0603]  (hidden comment: Capacitor)
C31  value 100nF  [C0402]  (hidden comment: Capacitor)
C34  value 10nF  [C0402]  (hidden comment: Capacitor)
C45  value 4.7uF  [C1206_H1P25]  (hidden comment: Capacitor)
C50  value 4.7uF  [C0402]  (hidden comment: Capacitor)
C51  value 4.7uF  [C1206_H1P25]  (hidden comment: Capacitor)
C52  value 100nF  [C0603]  (hidden comment: Capacitor)
C53  value 100nF  [C0402]  (hidden comment: Capacitor)
C54  value 10nF  [C0402]  (hidden comment: Capacitor)
C56  value 33pF  [C0402]  (hidden comment: Capacitor)
CN16  value Socket_FFC/FPC_5051104091  [CON_MOLEX_5051104091]  (hidden comment: 5051104091)
D2  STPS1L40M  [DIO_DO216-AA]
L3  value 4.7uH  [L1210_LQH]  (hidden comment: Inductor)
R35  value 0R  [R0603]  (hidden comment: Resistor)
R44  value 100K  [R0402]  (hidden comment: Resistor)
R49  value 10R  [R0603]  (hidden comment: Resistor)
R53  value 4K7  [R0402]  (hidden comment: Resistor)
R57  value 0R  [R0402]  (hidden comment: Resistor)
R58  value 4K7  [R0402]  (hidden comment: Resistor)
R59  value 4K7  [R0402]  (hidden comment: Resistor)
R60  value 0R  [R0402]  (hidden comment: Resistor)
TP37  Test Point  [TP_SMD_1MM]  (value not drawn)  (no BOM)
TP40  Test Point  [TP_SMD_1MM]  (value not drawn)  (no BOM)
TP41  Test Point  [TP_SMD_1MM]  (value not drawn)  (no BOM)
TP42  Test Point  [TP_SMD_1MM]  (value not drawn)  (no BOM)
TP43  Test Point  [TP_SMD_1MM]  (value not drawn)  (no BOM)
U9  STLD40DPUR  [ICC_QFN8-EPAD_3X3_P065]
U35  RK043FN78H-CT661C  [LCD_DRAWING_ROCKTEK_RK043FN78H-CT661C]

### Ports
I2C5_SCL (in), I2C5_SDA (bidir), LCD (harness LCD), LCD_DISP (in), LCD_RST (in)

### Harnesses
LCD: LCD_R[2..7], LCD_G[2..7], LCD_B[2..7], LCD_HSYNC, LCD_VSYNC, LCD_DE, LCD_CLK, LCD_BL, LCD_INT

### Nets
3V3_SW: C50.1 C53.2 CN16.4
5V_VIN: R35.1
GND: C29.2 C31.1 C34.1 C45.1 C50.2 C51.1 C52.1 C53.1 C54.1 C56.1 CN16.3 CN16.29 CN16.35 CN16.36 CN16.MT1 CN16.MT2 R44.1 R49.1 R53.1 R58.2 R59.1 U9.3(GND) U9.9(PGND)
LCD_B2: CN16.23
LCD_B3: CN16.24
LCD_B4: CN16.25
LCD_B5: CN16.26
LCD_B6: CN16.27
LCD_B7: CN16.28
LCD_BL: R57.1 ; port LCD.LCD_BL
LCD_BL_A: C54.2 CN16.2 R60.2
LCD_BL_K: CN16.1 R49.2 U9.4(FB)
LCD_CLK: CN16.30 TP41.1 ; port LCD.LCD_CLK
LCD_DE: CN16.34 TP40.1 ; port LCD.LCD_DE
LCD_DISP: CN16.31 R59.2 ; port LCD_DISP
LCD_G2: CN16.15
LCD_G3: CN16.16
LCD_G4: CN16.17
LCD_G5: CN16.18
LCD_G6: CN16.19
LCD_G7: CN16.20
LCD_HSYNC: CN16.32 TP43.1 ; port LCD.LCD_HSYNC
LCD_INT: CN16.38 TP42.1 ; port LCD.LCD_INT
LCD_R2: CN16.7
LCD_R3: CN16.8
LCD_R4: CN16.9
LCD_R5: CN16.10
LCD_R6: CN16.11
LCD_R7: CN16.12
LCD_RST: CN16.37 R58.1 ; port LCD_RST
LCD_SCL: CN16.39 ; port I2C5_SCL  [project net EXP_GPIO3]
LCD_SDA: CN16.40 ; port I2C5_SDA  [project net EXP_GPIO2]
LCD_VSYNC: CN16.33 TP37.1 ; port LCD.LCD_VSYNC
VH: C45.2 C51.2 C52.2 C56.2 D2.2(K) R60.1 U9.6(Vo)
VL: C29.1 C31.2 C34.2 L3.1 R35.2 U9.1(Vi)
NetD2_1: D2.1(A) L3.2 U9.8(SW)
NetR44_2: R44.2 U9.2(Rset)
NetR53_2: R53.2 R57.2 U9.7(EN)

Not connected (* = marked no-connect by the designer): CN16 5* 6* 13* 14* 21* 22*; U9 5(NC)*; U35 1(VBL-)* 2(VBL+)* 3(GND)* 4(VDD)* 5(R0)* 6(R1)* 7(R2)* 8(R3)* 9(R4)* 10(R5)* 11(R6)* 12(R7)* 13(G0)* 14(G1)* 15(G2)* 16(G3)* 17(G4)* 18(G5)* 19(G6)* 20(G7)* 21(B0)* 22(B1)* 23(B2)* 24(B3)* 25(B4)* 26(B5)* 27(B6)* 28(B7)* 29(GND)* 30(CLK)* 31(DISP)* 32(HSYNC)* 33(VSYNC)* 34(DE)* 35(GND)* 36(GND)* 37(RESET)* 38(INT)* 39(SCL)* 40(SDA)*

### Buses and harness runs
bus LCD_B[2..7]
bus LCD_G[2..7]
bus LCD_R[2..7]

### Notes on the sheet
- LCD 4.3"
- PE12
- PG7
- PB12
- PD14
- PE7
- LCD_CLK
- (near U35) LCD_HSYNC
- PE13
- PE9
- PH13
- (near U35) LCD_VSYNC
- LCD_DE
- LCD_DISP
- LCD_R2
- LCD_R3
- LCD_R4
- LCD_R5
- LCD_R6
- PF3
- PD5
- PG0
- PC7
- PA15
- (near CN16) INSERT
  FLAT CABLE
- LCD_BL_A
- LCD_BL_K
- LCD_R7
- LCD_G2
- PD10
- PF2
- PH14
- LCD_INT
- LCD_RST
- LCD_SCL
- LCD_SDA
- LCD_G3
- LCD_G4
- LCD_G5
- LCD_G6
- LCD_G7
- PE0
- PB6
- PF1
- PD9
- 3V3_SW
- LCD_B2
- LCD_B3
- PG4
- PC6
- PH9
- PI7
- GND
- LCD_B4
- LCD_B5
- LCD_B6
- LCD_B7
- PH6
- PD1
- PF5
- PH2
- (near U35) LCD DISPLAY MODULE
  WITH FLAT CABLE
- (near U35) Default I2C Address : 1011101X
- Title:
- Project:
- Size:
- Revision:
- Variant:
- A4
- -
- Date:
- Reference:
- Sheet:
- of

### Library data of the parts
C29 = MCD-00099: Capacitor, MLCC, 10uF, 10V, X5R, +/-10%, 0603, T=0.8mm; Manufacturer_Part_Number: GRM188R61A106KE69D; Manufacturer: MURATA; Part_Preference: Recommended; Order_Code_RS: 170-6168; Component_Country_Of_Origin: Japan; ShowFields: YES; ID: 2770; Internal_Part_Number: MCD-00099; Status: Released; Part_Type: Capacitor; ComponentLink1URL: http://tunmcdsvn.tun.st.com/Component_Documentation_Library/Trunk/Capacitor/MURATA_GRM_Series; Order_Code_Digikey: 490-10474-1-ND; Order_Code_Farnell: 2494233; Package: 0603
C31 C53 = MCD-00006: Capacitor, MLCC, 100nF, 16V, X7R, +/-10%, 0402, T=0.5mm; Manufacturer_Part_Number: CC0402KRX7R7BB104; Manufacturer: YAGEO; Part_Preference: Recommended; Order_Code_RS: 616-9701; Component_Country_Of_Origin: China; ShowFields: YES; ID: 2474; Internal_Part_Number: MCD-00006; Status: Released; Part_Type: Capacitor; Package: 0402; ComponentLink1URL: http://tunmcdsvn.tun.st.com/Component_Documentation_Library/Trunk/Capacitor/YAGEO_X7R_Series; Order_Code_Digikey: 311-1338-1-ND; Order_Code_Farnell: 9402047
C34 C54 = MCD-02198: Capacitor, MLCC, 10nF, 50V, X7R, +/-10%, 0402, T=0.5mm; Manufacturer_Part_Number: CC0402KRX7R9BB103; Manufacturer: YAGEO; Part_Preference: Recommended; Order_Code_RS: 6169644; Component_Country_Of_Origin: China; ShowFields: YES; ID: 4298; Internal_Part_Number: MCD-02198; Status: Checked; Part_Type: Capacitor; Package: 0402; ComponentLink1URL: http://tunmcdsvn.tun.st.com/Component_Documentation_Library/Trunk/Capacitor/YAGEO_X7R_Series; Order_Code_Digikey: N/A; Order_Code_Farnell: N/A
C45 C51 = MCD-00013: Capacitor, MLCC, 4.7uF, 50V, X7R, +/-10%, 1206, T=1.27mm; Manufacturer_Part_Number: 12065C475KAT2A; Manufacturer: AVX; Part_Preference: Recommended; Order_Code_RS: 178-0947; Component_Country_Of_Origin: China, Penang; ShowFields: YES; ID: 2466; Internal_Part_Number: MCD-00013; Status: Released; Part_Type: Capacitor; Package: 1206; ComponentLink1URL: http://tunmcdsvn.tun.st.com/Component_Documentation_Library/Trunk/Capacitor/AVX_CG0_NP0_Series; Order_Code_Digikey: 478-6653-1-ND; Order_Code_Farnell: 1908177
C50 = MCD-01356: Capacitor, MLCC, 4.7uF, 6V3, X5R, +/-20%, 0402, T=0.5mm; Manufacturer_Part_Number: GRM155R60J475ME47; Manufacturer: MURATA; Part_Preference: Recommended; Order_Code_RS: 814-5230; Component_Country_Of_Origin: Japan; ShowFields: YES; ID: 3456; Internal_Part_Number: MCD-01356; Status: Released; Part_Type: Capacitor; ComponentLink1URL: http://tunmcdsvn.tun.st.com/Component_Documentation_Library/Trunk/Capacitor/MURATA_GRM_Series; Order_Code_Digikey: 490-5915-1-ND; Order_Code_Farnell: 2666407; Package: 0402
C52 = MCD-01099: Capacitor, MLCC, 100nF, 50V, X7R, +/-10%, 0603, T=0.8mm; BMS_Part_Number: 9142278; Part_Preference: Recommended; Manufacturer: YAGEO; Manufacturer_Part_Number: CC0603KRX7R9BB104; Order_Code_RS: 669-8767; Component_Country_Of_Origin: China; ShowFields: YES; ID: 3397; Internal_Part_Number: MCD-01099; Status: Released; Part_Type: Capacitor; Package: 0603; ComponentLink1URL: http://tunmcdsvn.tun.st.com/Component_Documentation_Library/Trunk/Capacitor/YAGEO_X7R_Series; Order_Code_Digikey: 311-1344-1-ND; Order_Code_Farnell: 1362556
C56 = MCD-00277: Capacitor, MLCC, 33pF, 50V, NPO,+/-5%, 0402, T=0.5mm; Part_Preference: Recommended; Manufacturer: YAGEO; Manufacturer_Part_Number: CC0402JRNPO9BN330; Component_Country_Of_Origin: China; ShowFields: YES; ID: 2592; Internal_Part_Number: MCD-00277; Status: Released; Part_Type: Capacitor; Package: 0402; ComponentLink1URL: http://tunmcdsvn.tun.st.com/Component_Documentation_Library/Trunk/Capacitor/YAGEO_NP0_Series; Order_Code_Digikey: 311-1020-1-ND; Order_Code_Farnell: 3019196; Order_Code_RS: N/A
CN16 = MCD-02589: Socket_FFC/FPC, 40pins, 0.5mm, RA, SMD, T=1.9mm; Part_Type: Connector; Part_Preference: Recommended; Manufacturer: MOLEX; Order_Code_RS: 178-8776; ShowFields: YES; ID: 4695; Status: Checked; ComponentLink1URL: http://tunmcdsvn.tun.st.com/Component_Documentation_Library/Trunk/Connector/MOLEX_505110_Series; Internal_Part_Number: MCD-02589; Manufacturer_Part_Number: 5051104091; Order_Code_Digikey: WM11292; Order_Code_Farnell: 3051373
D2 = MCD-00033: Low Drop power Schottky rectifier(1A, 40V, 0.4V); Part_Type: Diode; Manufacturer: STMICROELECTRONICS; BMS_Part_Number: 9151085; Part_Preference: Recommended; Manufacturer_HQ_COO: EU; Component_Country_Of_Origin: China; ShowFields: YES; ID: 2485; Internal_Part_Number: MCD-00033; Value: STPS1L40M; Status: Released; Manufacturer_Part_Number: STPS1L40M; ComponentLink1URL: http://tunmcdsvn.tun.st.com/Component_Datasheet_Library/Trunk/Diodes/STM_Diode_STPS1L40M_DO216-AA
L3 = MCD-00048: Inductor, 4.7uH, +/-30%, 1A, 180mR, 1210, T=1.7mm; Manufacturer_Part_Number: LQH32PN4R7NN0L; Manufacturer: MURATA; Part_Preference: Recommended; Order_Code_RS: 167-4086; Component_Country_Of_Origin: Japan; ShowFields: YES; ID: 2544; Internal_Part_Number: MCD-00048; Status: Released; Part_Type: Inductor; ComponentLink1URL: http://tunmcdsvn.tun.st.com/Component_Documentation_Library/Trunk/Inductor/MURATA_LQH32PN4R7NN0; Package: 1210; Order_Code_Digikey: 490-5338-2-ND; Order_Code_Farnell: 2470296
R35 = MCD-00181: Resistor, 0R, 0603, +/- 0.5mR, 1/4W; Part_Preference: Recommended; Manufacturer: ROHM; Manufacturer_Part_Number: PMR03EZPJ000; Component_Country_Of_Origin: Philippines, Thailand; ShowFields: YES; ID: 2691; Internal_Part_Number: MCD-00181; Status: Released; Part_Type: Resistor; Package: 0603; ComponentLink1URL: http://tunmcdsvn.tun.st.com/Component_Documentation_Library/Trunk/Resistor/ROHM_PMR_Series; Order_Code_Digikey: PMR03EZPJ000-ND; Order_Code_Farnell: N/A; Order_Code_RS: N/A
R44 = MCD-00059: Resistor, 100K, 0402, +/-1%, 1/16W; Manufacturer_Part_Number: RC0402FR-07100KL; Manufacturer: YAGEO; Part_Preference: Recommended; Component_Country_Of_Origin: China; ShowFields: YES; ID: 2533; Internal_Part_Number: MCD-00059; Status: Released; Part_Type: Resistor; Package: 0402; ComponentLink1URL: http://tunmcdsvn.tun.st.com/Component_Documentation_Library/Trunk/Resistor/YAGEO_RC_L_Series; Order_Code_Digikey: 311-100KLRTR-ND; Order_Code_Farnell: 2421891; Order_Code_RS: N/A
R49 = MCD-00060: Resistor, 10R, 0603, +/-1%, 1/4W; Manufacturer_Part_Number: ESR03EZPF10R0; Manufacturer: ROHM; Part_Preference: Recommended; Order_Code_RS: 167-3753; Component_Country_Of_Origin: Philippines, Thailand; ShowFields: YES; ID: 2531; Internal_Part_Number: MCD-00060; Status: Released; Part_Type: Resistor; Package: 0603; ComponentLink1URL: http://tunmcdsvn.tun.st.com/Component_Documentation_Library/Trunk/Resistor/ROHM_ESR_Series; Order_Code_Digikey: RHM10.0ADCT-ND; Order_Code_Farnell: 2887146
R53 R58 R59 = MCD-00065: Resistor, 4K7, 0402, +/-1%, 1/16W; Manufacturer_Part_Number: RC0402FR-074K7L; Manufacturer: YAGEO; Part_Preference: Recommended; Component_Country_Of_Origin: China; ShowFields: YES; ID: 2526; Internal_Part_Number: MCD-00065; Status: Released; Part_Type: Resistor; Package: 0402; ComponentLink1URL: http://tunmcdsvn.tun.st.com/Component_Documentation_Library/Trunk/Resistor/YAGEO_RC_L_Series; Order_Code_Digikey: 311-4.7KLRCT-ND; Order_Code_Farnell: 9239316; Order_Code_RS: N/A
R57 = MCD-00052: Resistor, 0R, 0402, +/-5%, 1/16W; Manufacturer_Part_Number: RC0402JR-070RL; Manufacturer: YAGEO; Part_Preference: Recommended; Order_Code_RS: 618-5804; Component_Country_Of_Origin: China; ShowFields: YES; ID: 2540; Internal_Part_Number: MCD-00052; Status: Released; Part_Type: Resistor; Package: 0402; ComponentLink1URL: http://tunmcdsvn.tun.st.com/Component_Documentation_Library/Trunk/Resistor/YAGEO_RC_L_Series; Order_Code_Digikey: 311-0.0JRCT-ND; Order_Code_Farnell: 9232516RL
R60 = MCD-00052: Resistor, 0R, 0402, +/-5%, 1/16W; Part_Preference: Recommended; Manufacturer: YAGEO; Manufacturer_Part_Number: RC0402JR-070RL; Order_Code_RS: 618-5804; Component_Country_Of_Origin: China; ShowFields: YES; ID: 2540; Internal_Part_Number: MCD-00052; Status: Released; Part_Type: Resistor; Package: 0402; ComponentLink1URL: http://tunmcdsvn.tun.st.com/Component_Documentation_Library/Trunk/Resistor/YAGEO_RC_L_Series; Order_Code_Digikey: 311-0.0JRCT-ND; Order_Code_Farnell: 9232516RL
TP37 TP40-TP43 = MCD-00074: Test Point 1mm; Part_Type: Misc; Part_Preference: Recommended; ShowFields: YES; ID: 2518; Internal_Part_Number: MCD-00074; Status: Released; Manufacturer_Part_Number: N/A; Manufacturer: N/A; ComponentLink1URL: http://na; Order_Code_Digikey: N/A; Order_Code_Farnell: N/A; Order_Code_RS: N/A
U9 = MCD-00082: White LED power supply for large display backlight, QFN8; Part_Type: IC; Manufacturer: STMICROELECTRONICS; BMS_Part_Number: 9176009; Part_Preference: Recommended; Manufacturer_HQ_COO: EU; Component_Country_Of_Origin: Malaysia; ShowFields: YES; ID: 2510; Internal_Part_Number: MCD-00082; Value: STLD40DPUR; Status: Released; Manufacturer_Part_Number: STLD40DPUR; ComponentLink1URL: http://tunmcdsvn.tun.st.com/Component_Datasheet_Library/Trunk/IC/STM_White-LED-PWR_STLD40DPUR_QFN8
U35 = MCD-02422: LCD,  TFT, 4.3 inch, 480x272 pixels with LED Backlight and Capacitive touch panel, high luminance with 0.5mm pitch flat cable; Part_Type: Display; Manufacturer_Part_Number: RK043FN78HV-CT661C; Manufacturer: ROCKTECH; Part_Preference: Recommended; Component_Country_Of_Origin: Unknown; ShowFields: YES; ID: 4528; Internal_Part_Number: MCD-02422; Value: RK043FN78H-CT661C; Status: Released; ComponentLink1URL: http://tunmcdsvn.tun.st.com/Component_Documentation_Library/Trunk/Display/ROCKTECH_RK043FN78H-CT661C; Order_code_Digikey: N/A; Order_code_Farnell: N/A; Order_code_RS: N/A